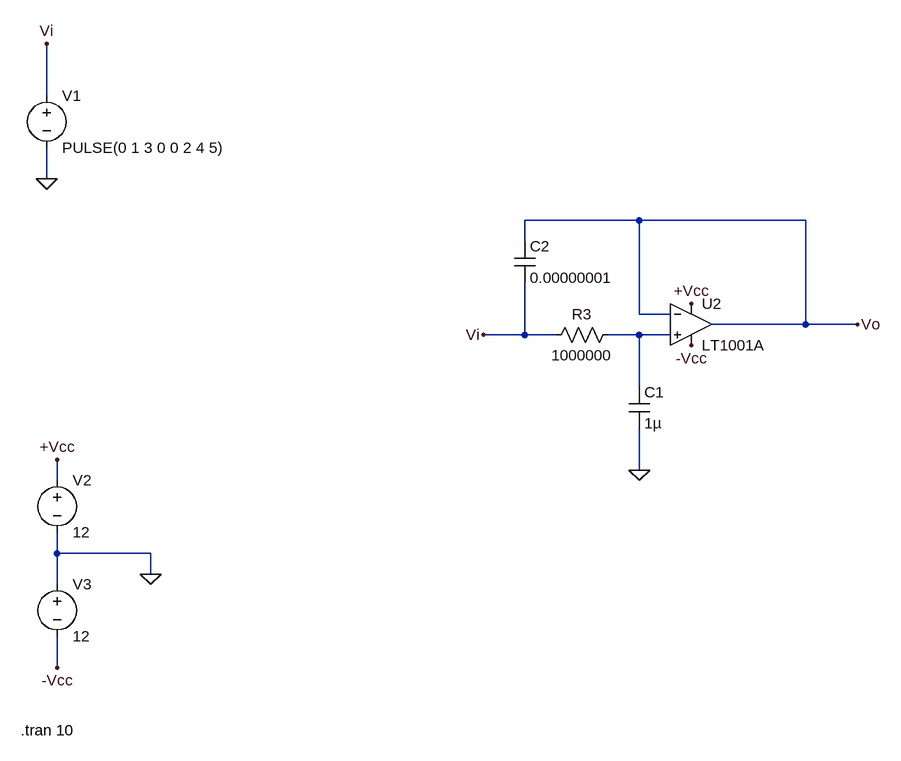
[diagram p0: schematic Circuito_G_transfer_feedback.asc]
Circuito_G_transfer_feedback.asc, the LTspice schematic file:
Version 4
SHEET 1 1532 1056
WIRE -1936 -32 -1936 -112
WIRE -1936 96 -1936 48
WIRE -1024 160 -1200 160
WIRE -768 160 -1024 160
WIRE -1200 192 -1200 160
WIRE -1024 304 -1024 160
WIRE -976 304 -1024 304
WIRE -768 320 -768 160
WIRE -768 320 -912 320
WIRE -688 320 -768 320
WIRE -1200 336 -1200 256
WIRE -1200 336 -1264 336
WIRE -1152 336 -1200 336
WIRE -1024 336 -1072 336
WIRE -976 336 -1024 336
WIRE -1024 416 -1024 336
WIRE -1024 544 -1024 480
WIRE -1920 560 -1920 528
WIRE -1920 672 -1920 640
WIRE -1776 672 -1920 672
WIRE -1776 704 -1776 672
WIRE -1920 720 -1920 672
WIRE -1920 848 -1920 800
FLAG -1936 96 0
FLAG -1776 704 0
FLAG -1920 528 +Vcc
FLAG -1920 848 -Vcc
FLAG -944 288 +Vcc
FLAG -944 352 -Vcc
FLAG -1264 336 Vi
FLAG -688 320 Vo
FLAG -1936 -112 Vi
FLAG -1024 544 0
SYMBOL voltage -1936 -48 R0
WINDOW 123 0 0 Left 0
WINDOW 39 0 0 Left 0
SYMATTR InstName V1
SYMATTR Value PULSE(0 1 3 0 0 2 4 5)
SYMBOL voltage -1920 544 R0
WINDOW 123 0 0 Left 0
WINDOW 39 0 0 Left 0
SYMATTR InstName V2
SYMATTR Value 12
SYMBOL voltage -1920 704 R0
WINDOW 123 0 0 Left 0
WINDOW 39 0 0 Left 0
SYMATTR InstName V3
SYMATTR Value 12
SYMBOL OpAmps\\LT1001A -944 256 R0
SYMATTR InstName U2
SYMBOL res -1056 320 R90
WINDOW 0 0 56 VBottom 2
WINDOW 3 32 56 VTop 2
SYMATTR InstName R3
SYMATTR Value 1000000
SYMBOL cap -1040 416 R0
SYMATTR InstName C1
SYMATTR Value 1µ
SYMBOL cap -1216 192 R0
SYMATTR InstName C2
SYMATTR Value 0.00000001
TEXT -1976 944 Left 2 !.tran 10

The netlist it stands for:
* Circuito_G_transfer_feedback.asc
V1 Vi 0 PULSE(0 1 3 0 0 2 4 5)
V2 +Vcc 0 12
V3 0 -Vcc 12
XU2 N001 Vo +Vcc -Vcc Vo LT1001  ; LT1001A, pins In+ In- V+ V- OUT
R3 N001 Vi 1000000
C1 N001 0 1µ
C2 Vo Vi 0.00000001
.tran 10
.lib LTC.lib
.backanno
.end